# EAGLE design SK3000v5 LOGO (EAGLE 7.2.0)
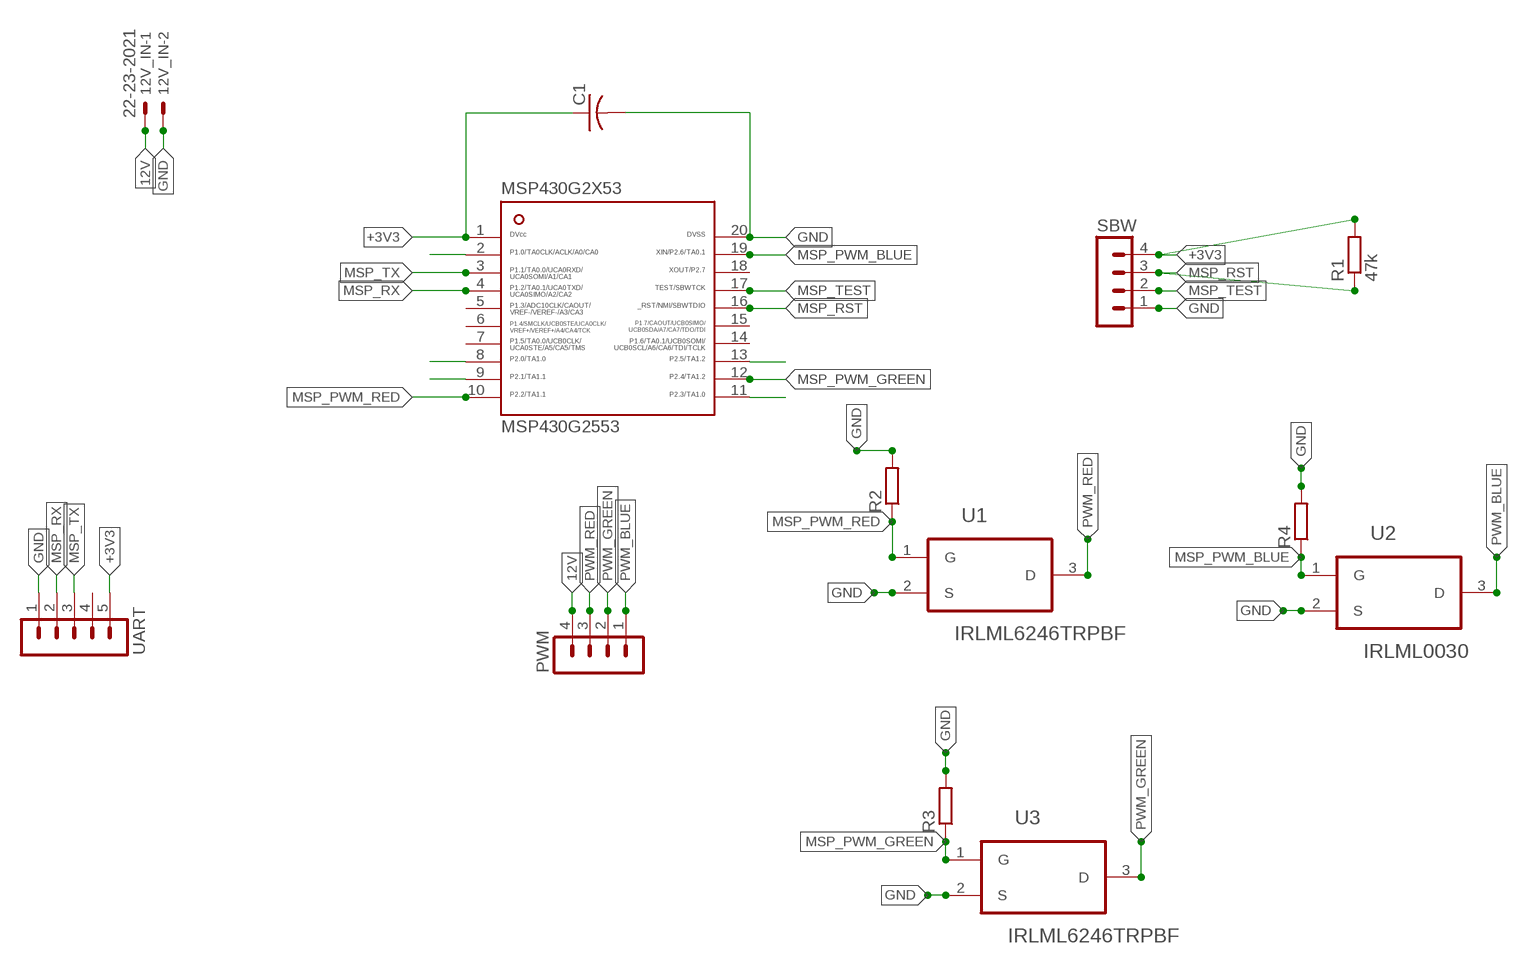
[diagram p0: schematic, sheet 1]

## Parts
12V_IN  22-23-2021  [22-23-2021]
C1  C-USC0603  [C0603]
MSP430G2553  MSP430G2X53-20PW20  [PW20]
PWM  MA04-1  [MA04-1]
R1  47k  R-EU_R0603  [R0603]
R2  R-EU_R0603  [R0603]
R3  R-EU_R0603  [R0603]
R4  R-EU_R0603  [R0603]
SBW  MA04-1  [MA04-1]
U1  IRLML6246TRPBF  [SOT95P240X112-3N]
U2  IRLML0030  IRLML6246TRPBF  [SOT95P240X112-3N]
U3  IRLML6246TRPBF  [SOT95P240X112-3N]
UART  MA05-1  [MA05-1]

## Nets
12V: 12V_IN.1 PWM.4
+3V3: C1.1 MSP430G2553.1 R1.2 SBW.4 UART.5
GND: 12V_IN.2 C1.2 MSP430G2553.20 R2.2 R3.2 R4.2 SBW.1 U1.2(S) U2.2(S) U3.2(S) UART.1
MSP_PWM_BLUE: MSP430G2553.19 R4.1 U2.1(G)
MSP_PWM_GREEN: MSP430G2553.12 R3.1 U3.1(G)
MSP_PWM_RED: MSP430G2553.10 R2.1 U1.1(G)
MSP_RST: MSP430G2553.16 R1.1 SBW.3
MSP_RX: MSP430G2553.4 UART.2
MSP_TEST: MSP430G2553.17 SBW.2
MSP_TX: MSP430G2553.3 UART.3
N$32: MSP430G2553.2
N$33: MSP430G2553.8
N$34: MSP430G2553.9
N$36: MSP430G2553.13
N$37: MSP430G2553.11
PWM_BLUE: PWM.1 U2.3(D)
PWM_GREEN: PWM.2 U3.3(D)
PWM_RED: PWM.3 U1.3(D)
Unconnected: MSP430G2553.5 MSP430G2553.6 MSP430G2553.7 MSP430G2553.14 MSP430G2553.15 MSP430G2553.18 UART.4

## Library data of the parts
12V_IN = con-molex:22-23-2021: .100" (2.54mm) Center Header - 2 Pin; MF: MOLEX; MPN: 22-23-2021; OC_FARNELL: 1462926; OC_NEWARK: 25C3832
C1 = adafruit:C-US: CAPACITOR, American symbol
MSP430G2553 = ti_msp430:MSP430G2X53-20
PWM SBW = con-lstb:MA04-1: PIN HEADER; OC_FARNELL: unknown; OC_NEWARK: unknown
R1-R4 = rcl:R-EU_: RESISTOR, European symbol
U1-U3 = International_Rectifier_By_element14_Batch_1:IRLML6246TRPBF: Power MOSFET; MPN: IRLML6246TRPBF; OC_FARNELL: 1857343; OC_NEWARK: 84R9707; PACKAGE: SOT-23-3; SUPPLIER: INTERNATIONAL RECTIFIER
UART = con-lstb:MA05-1: PIN HEADER; OC_FARNELL: unknown; OC_NEWARK: unknown

## Board
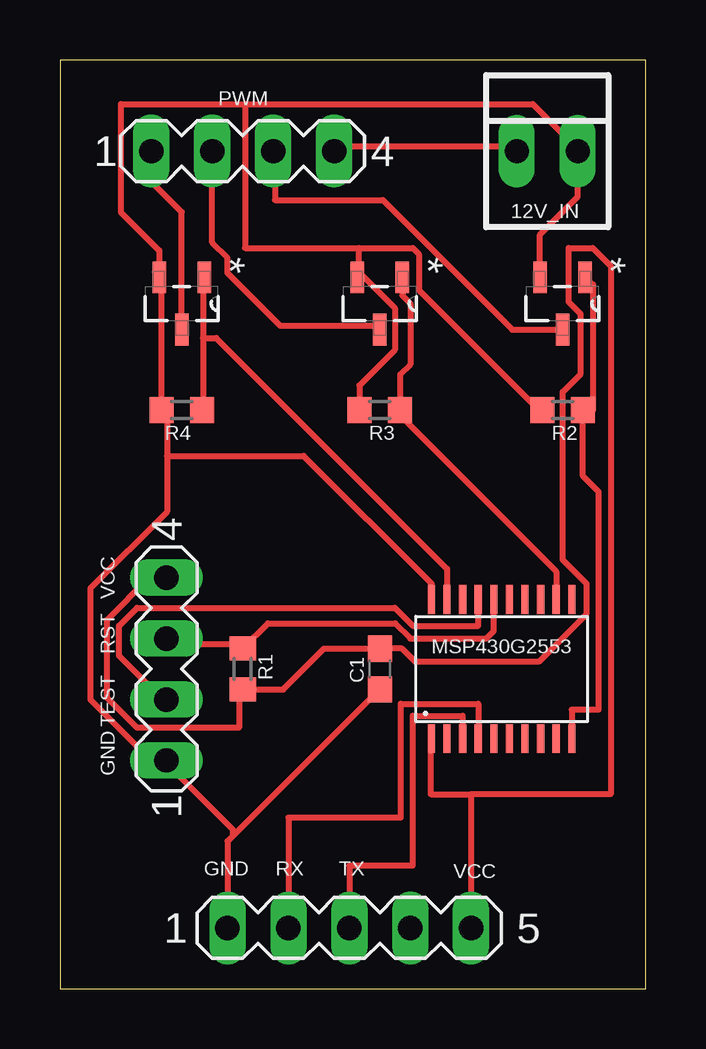
[diagram p1: board, top side]
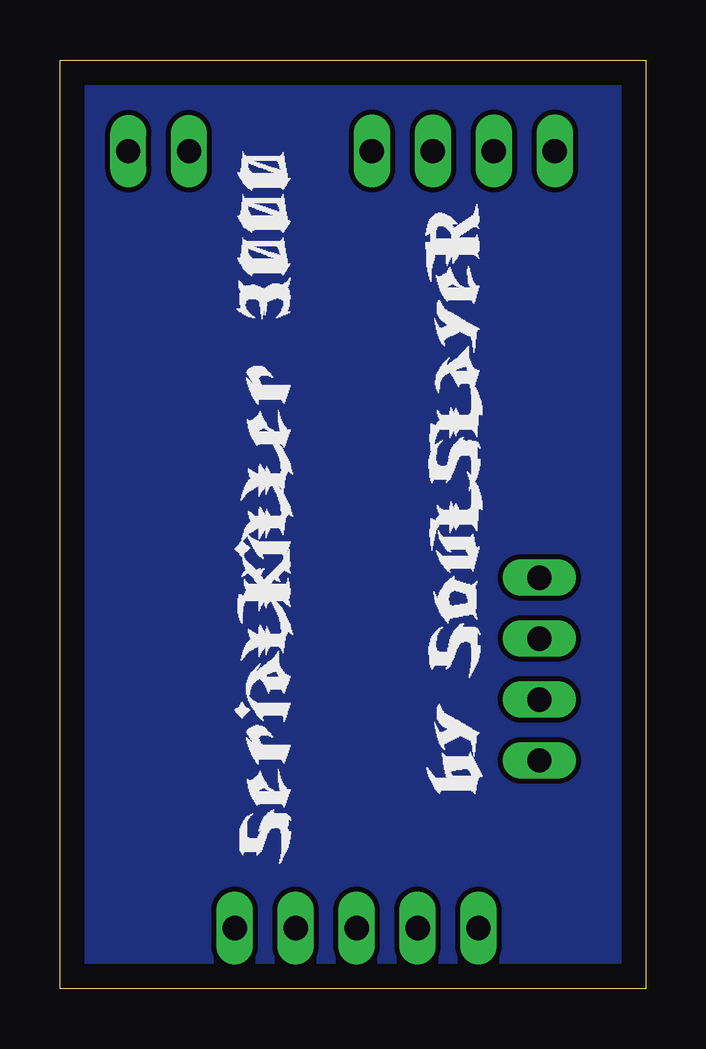
[diagram p2: board, bottom side, seen from below]

Size 24.43 x 38.73 mm. Coordinates in mm from the lower left corner, seen from the top.
Outline: 0,0 24.43,0 24.43,38.73 0,38.73 0,0
Copper layers (1*16): Top 0.035mm / dielectric 1.5mm / Bottom 0.035mm
Design rules "default": minimum track width 10mil, minimum drill 24mil, track to track 8mil, track to pad 8mil, pad to pad 8mil, via to via 8mil, smd to smd 8mil, copper to edge 40mil, drill to drill 8mil, minimum pad ring 10mil, minimum via ring 8mil, stop-mask expansion 4mil, vias tented up to drill 0mil, thermal gap 10mil

### Footprints (pad centres in the part's own frame; a part is rotated, then mirrored left to right if it is on the bottom)
22-23-2021 = drill 1 long: 1 -1.27,0; 2 1.27,0
C0603 = smd 1.1 x 1: 1 -0.85,0; 2 0.85,0
PW20 = smd 0.3 x 1.2: 1 -2.925,-2.9; 2 -2.275,-2.9; 3 -1.625,-2.9; 4 -0.975,-2.9; 5 -0.325,-2.9; 6 0.325,-2.9; 7 0.975,-2.9; 8 1.625,-2.9; 9 2.275,-2.9; 10 2.925,-2.9; 11 2.925,2.9; 12 2.275,2.9; 13 1.625,2.9; 14 0.975,2.9; 15 0.325,2.9; 16 -0.325,2.9; 17 -0.975,2.9; 18 -1.625,2.9; 19 -2.275,2.9; 20 -2.925,2.9
MA04-1 = drill 1.016 long: 1 -3.81,0; 2 -1.27,0; 3 1.27,0; 4 3.81,0
R0603 = smd 1 x 1.1: 1 -0.85,0; 2 0.85,0
SOT95P240X112-3N = smd 1.321 x 0.559: 1 -1.092,0.94; 2 -1.092,-0.94; 3 1.092,0
MA05-1 = drill 1.016 long: 1 -5.08,0; 2 -2.54,0; 3 0,0; 4 2.54,0; 5 5.08,0

### Placement (x,y rotation side)
12V_IN  20.32,34.92 0 top
C1  13.34,13.34 270 top
MSP430G2553  18.41,13.34 0 top
PWM  7.62,34.92 0 top
R1  7.62,13.34 270 top
R2  20.95,24.13 180 top
R3  13.34,24.13 180 top
R4  5.08,24.13 180 top
SBW  4.45,13.34 90 top
U1  20.95,28.57 270 top
U2  5.08,28.57 270 top
U3  13.34,28.57 270 top
UART  12.06,2.54 0 top

### Tracks (layer width: path | path; a pad name or v marks a point on that pad's centre or on a via)
12V
  Top 0.254: 12V_IN.1 18.96,35.13 11.46,35.13 PWM.4
+3V3
  Top 0.254: MSP430G2553.1 15.46,10.38 15.46,8.12 17.14,8.12 | 17.14,8.12 22.96,8.12 22.96,30.14 22.21,30.89 21.21,30.89 21.21,28.64 21.71,28.14 21.71,25.64 20.96,24.89 20.96,17.89 21.96,16.89 21.96,15.63 19.96,13.63 14.81,13.63 14.26,14.19 C1.1 | 13.46,14.13 C1.1 | 17.14,8.12 UART.5 | C1.1 11.01,14.19 9.31,12.48 R1.2 7.46,12.38 7.46,10.88 3.21,10.88 1.96,12.13 1.96,15.38 3.72,17.14 SBW.4
GND
  Top 0.254: 7.21,6.38 13.21,12.38 C1.2 | 7.21,6.38 7.21,6.63 4.46,9.38 SBW.1 3.81,9.53 1.27,12.06 1.27,16.7 4.46,19.89 4.46,22.23 | 12.46,29.89 13.96,28.39 13.96,26.64 12.48,25.16 R3.2 12.71,24.14 | 12.46,30.89 14.71,30.89 14.96,30.64 14.96,29.14 19.96,24.14 R2.2 | 12.46,29.89 12.46,30.89 | 12.46,29.89 U3.2 | U2.2 4.21,29.64 4.21,24.14 R4.2 4.46,23.89 4.46,22.23 | 15.46,16.39 MSP430G2553.20 15.49,16.89 10.16,22.23 4.46,22.23 | 7.71,36.88 2.54,36.88 2.54,32.38 4.14,30.79 U2.2 | 7.71,36.88 19.71,36.88 21.46,35.13 12V_IN.2 21.59,33.02 20.02,31.45 U1.2 | 3.96,29.89 U2.2 | 12.46,30.89 7.71,30.89 7.71,36.88 | 7.21,6.38 6.99,6.16 UART.1
MSP_PWM_BLUE
  Top 0.254: 5.96,27.14 5.96,29.64 U2.1 | 5.96,27.14 5.96,24.14 R4.1 | 5.96,27.14 6.52,27.14 16.14,17.52 MSP430G2553.19
MSP_PWM_GREEN
  Top 0.254: 14.46,24.39 14.21,24.14 R3.1 | R3.1 14.21,23.89 18.41,19.68 20.69,17.41 MSP430G2553.12 | U3.1 14.28,28.91 14.61,28.57 14.61,26.04 14.19,25.61 R3.1
MSP_PWM_RED
  Top 0.254: 22.21,24.39 21.96,24.14 R2.1 | U1.1 21.96,29.64 22.23,29.37 22.23,24.13 R2.1 | 21.96,23.89 R2.1 | MSP430G2553.10 21.34,11.63 22.46,11.63 22.46,20.72 21.8,21.38 R2.1
MSP_RST
  Top 0.254: SBW.3 4.46,14.38 7.46,14.38 R1.1 8.68,15.24 13.97,15.24 14.61,14.61 17.78,14.61 18.09,14.91 MSP430G2553.16
MSP_RX
  Top 0.254: MSP430G2553.4 17.44,11.88 14.21,11.88 14.21,7.13 9.53,7.13 UART.2
MSP_TEST
  Top 0.254: 17.46,16.14 MSP430G2553.17 17.44,15.13 14.71,15.13 13.96,15.88 3.21,15.88 2.46,15.13 2.46,13.88 4.21,12.13 SBW.2
MSP_TX
  Top 0.254: MSP430G2553.3 16.79,11.38 14.71,11.38 14.71,5.13 12.06,5.13 UART.3
N$1
  pour Bottom: 0.25,38.61 0.25,0 24.64,0 24.64,38.61 0.51,38.61
PWM_BLUE
  Top 0.254: U2.3 4.96,27.64 5.08,27.75 5.08,32.38 3.81,33.66 PWM.1
PWM_GREEN
  Top 0.254: U3.3 13.21,27.64 9.2,27.64 6.99,29.84 6.99,30.48 6.35,31.11 PWM.2
PWM_RED
  Top 0.254: PWM.3 8.96,34.88 8.96,32.88 13.46,32.88 18.86,27.48 U1.3

### Text on the board
tNames: VCC | RST | TEST | GND | GND | RX | TX | VCC